# Altium schematic sheet JS7628_base_usb_hub_v1.0.SchDoc
size A4
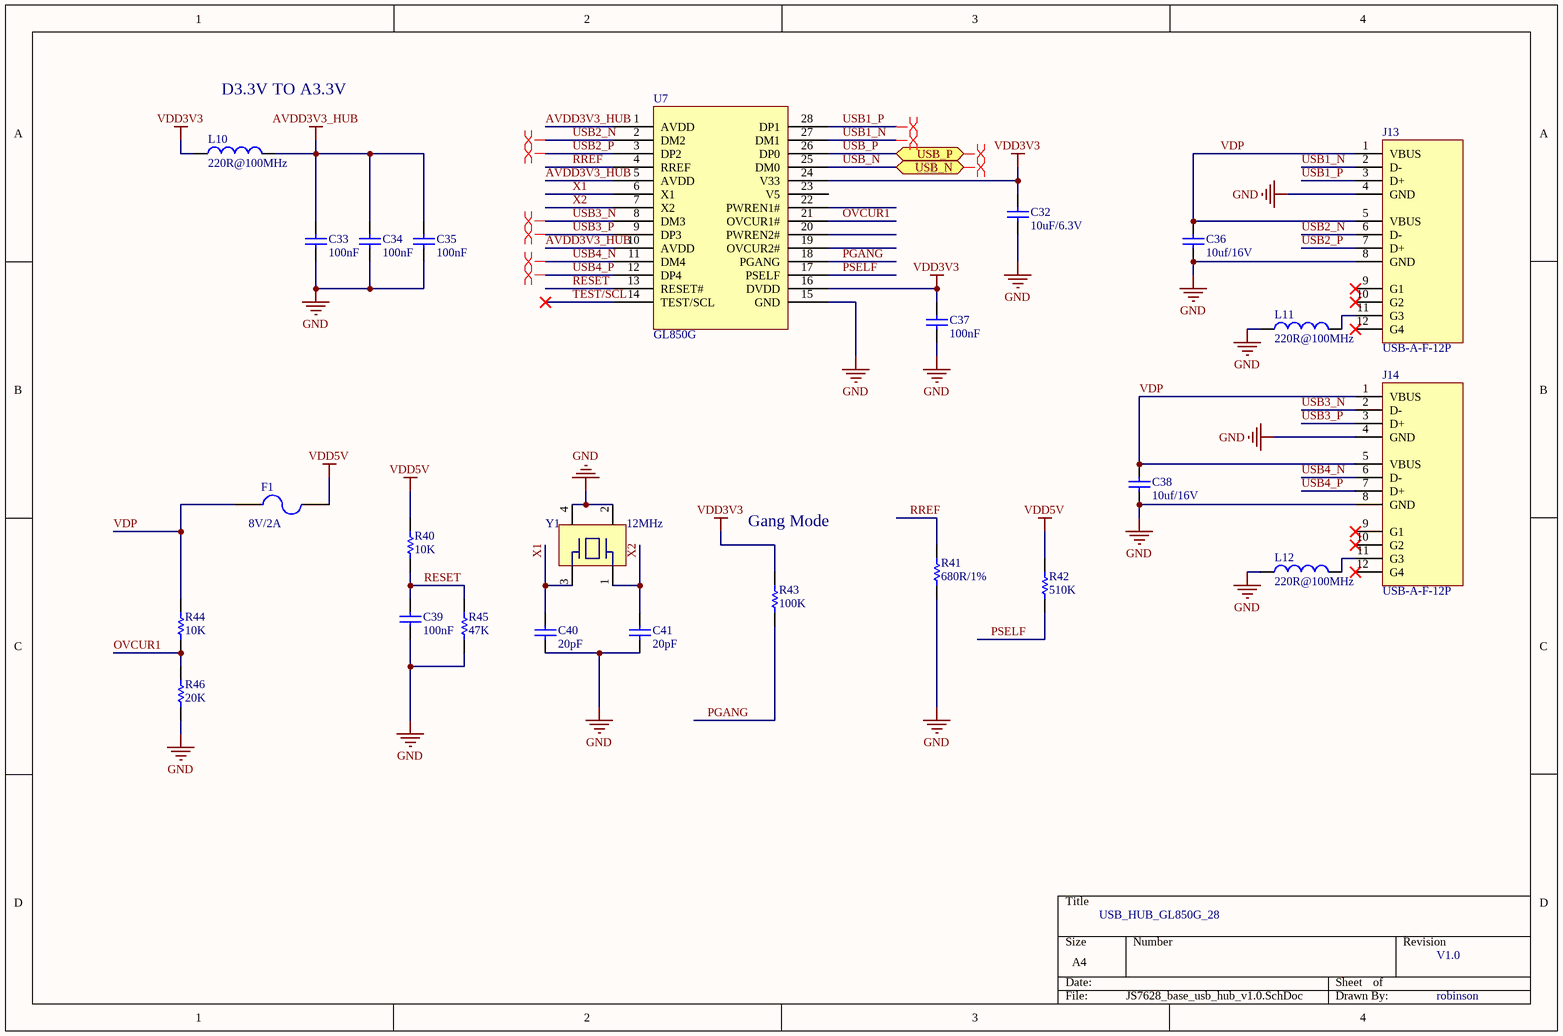
[diagram p0: JS7628_base_usb_hub_v1.0.SchDoc]

## Parts
C32  value 10uF/6.3V  [0603]  (hidden comment: CAP-SMT)
C33  value 100nF  [0603]  (hidden comment: CAP-SMT)
C34  value 100nF  [0603]  (hidden comment: CAP-SMT)
C35  value 100nF  [0603]  (hidden comment: CAP-SMT)
C36  value 10uf/16V  [0603]  (hidden comment: CAP-SMT)
C37  value 100nF  [0603]  (hidden comment: CAP-SMT)
C38  value 10uf/16V  [0603]  (hidden comment: CAP-SMT)
C39  value 100nF  [0603]  (hidden comment: CAP-SMT)
C40  value 20pF  [0603]  (hidden comment: CAP-SMT)
C41  value 20pF  [0603]  (hidden comment: CAP-SMT)
F1  value 8V/2A  [1812]  (hidden comment: FUSE)
J13  USB-A-F-12P  [USB-A-F-12P-90D]
J14  USB-A-F-12P  [USB-A-F-12P-90D]
L10  value 220R@100MHz  [0603]  (hidden comment: inductor)
L11  value 220R@100MHz  [0603]  (hidden comment: inductor)
L12  value 220R@100MHz  [0603]  (hidden comment: inductor)
R40  value 10K  [0603]  (hidden comment: RES-SMT)
R41  value 680R/1%  [0603]  (hidden comment: RES-SMT)
R42  value 510K  [0603]  (hidden comment: RES-SMT)
R43  value 100K  [0603]  (hidden comment: RES-SMT)
R44  value 10K  [0603]  (hidden comment: RES-SMT)
R45  value 47K  [0603]  (hidden comment: RES-SMT)
R46  value 20K  [0603]  (hidden comment: RES-SMT)
U7  GL850G  [SSOP28]
Y1  value 12MHz  [3225-4P]  (hidden comment: XTAL-4p)

## Ports
USB_N, USB_P

## Nets
AVDD3V3_HUB: C33.2 C34.2 C35.2 L10.2 U7.1(AVDD) U7.5(AVDD) U7.10(AVDD)
GND: C32.1 C33.1 C34.1 C35.1 C36.1 C37.1 C38.1 C39.1 C40.1 C41.1 J13.4(GND) J13.8(GND) J14.4(GND) J14.8(GND) L11.1 L12.1 R41.1 R45.1 R46.1 U7.15(GND) Y1.2 Y1.4
VDD3V3: C32.2 C37.2 L10.1 R43.2 U7.16(DVDD) U7.24(V33)
VDD5V: F1.2 R40.2 R42.2
OVCUR1: R44.1 R46.2 U7.21(OVCUR1#)
PGANG: R43.1 U7.18(PGANG)
PSELF: R42.1 U7.17(PSELF)
RESET: C39.2 R40.1 R45.2 U7.13(RESET#)
RREF: R41.2 U7.4(RREF)
TEST/SCL: U7.14(TEST/SCL)
USB1_N: J13.2(D-) U7.27(DM1)
USB1_P: J13.3(D+) U7.28(DP1)
USB2_N: J13.6(D-) U7.2(DM2)
USB2_P: J13.7(D+) U7.3(DP2)
USB3_N: J14.2(D-) U7.8(DM3)
USB3_P: J14.3(D+) U7.9(DP3)
USB4_N: J14.6(D-) U7.11(DM4)
USB4_P: J14.7(D+) U7.12(DP4)
USB_N: U7.25(DM0) ; port USB_N
USB_P: U7.26(DP0) ; port USB_P
VDP: C36.2 C38.2 F1.1 J13.1(VBUS) J13.5(VBUS) J14.1(VBUS) J14.5(VBUS) R44.2
X1: C40.2 U7.6(X1) Y1.3
X2: C41.2 U7.7(X2) Y1.1
NetJ13_11: J13.11(G3) L11.2
NetJ14_11: J14.11(G3) L12.2

Not connected (* = marked no-connect by the designer): J13 9(G1)* 10(G2)* 12(G4)*; J14 9(G1)* 10(G2)* 12(G4)*; U7 19(OVCUR2#) 20(PWREN2#) 22(PWREN1#) 23(V5)

## Layout directives
differential pair: USB1_N, USB1_P, USB2_N, USB2_P, USB3_N, USB3_P, USB4_N, USB4_P, USB_N, USB_P

## Notes on the sheet
- D3.3V TO A3.3V
- Gang Mode
- USB_HUB_GL850G_28
- V1.0
- robinson